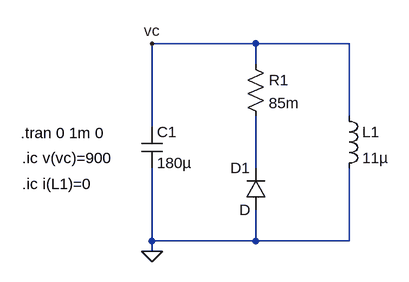
[diagram p0: schematic rlc.asc]
rlc.asc, the LTspice schematic file:
Version 4
SHEET 1 880 680
WIRE 208 -16 48 -16
WIRE 352 -16 208 -16
WIRE 208 16 208 -16
WIRE 352 96 352 -16
WIRE 48 112 48 -16
WIRE 208 176 208 96
WIRE 48 288 48 176
WIRE 208 288 208 240
WIRE 208 288 48 288
WIRE 352 288 352 176
WIRE 352 288 208 288
WIRE 48 304 48 288
FLAG 48 -16 vc
FLAG 48 304 0
SYMBOL cap 32 112 R0
SYMATTR InstName C1
SYMATTR Value 180µ
SYMBOL res 192 0 R0
SYMATTR InstName R1
SYMATTR Value 85m
SYMBOL diode 224 240 R180
WINDOW 0 24 64 Left 2
WINDOW 3 24 0 Left 2
SYMATTR InstName D1
SYMBOL ind 336 80 R0
SYMATTR InstName L1
SYMATTR Value 11µ
TEXT -152 160 Left 2 !.ic v(vc)=900
TEXT -154 122 Left 2 !.tran 0 1m 0
TEXT -152 200 Left 2 !.ic i(L1)=0

The netlist it stands for:
* rlc.asc
C1 vc 0 180µ
R1 vc N001 85m
D1 0 N001 D
L1 vc 0 11µ
.model D D
.lib standard.dio
.ic v(vc)=900
.tran 0 1m 0
.ic i(L1)=0
.backanno
.end